# Altium schematic sheet 主控.SchDoc
size A2
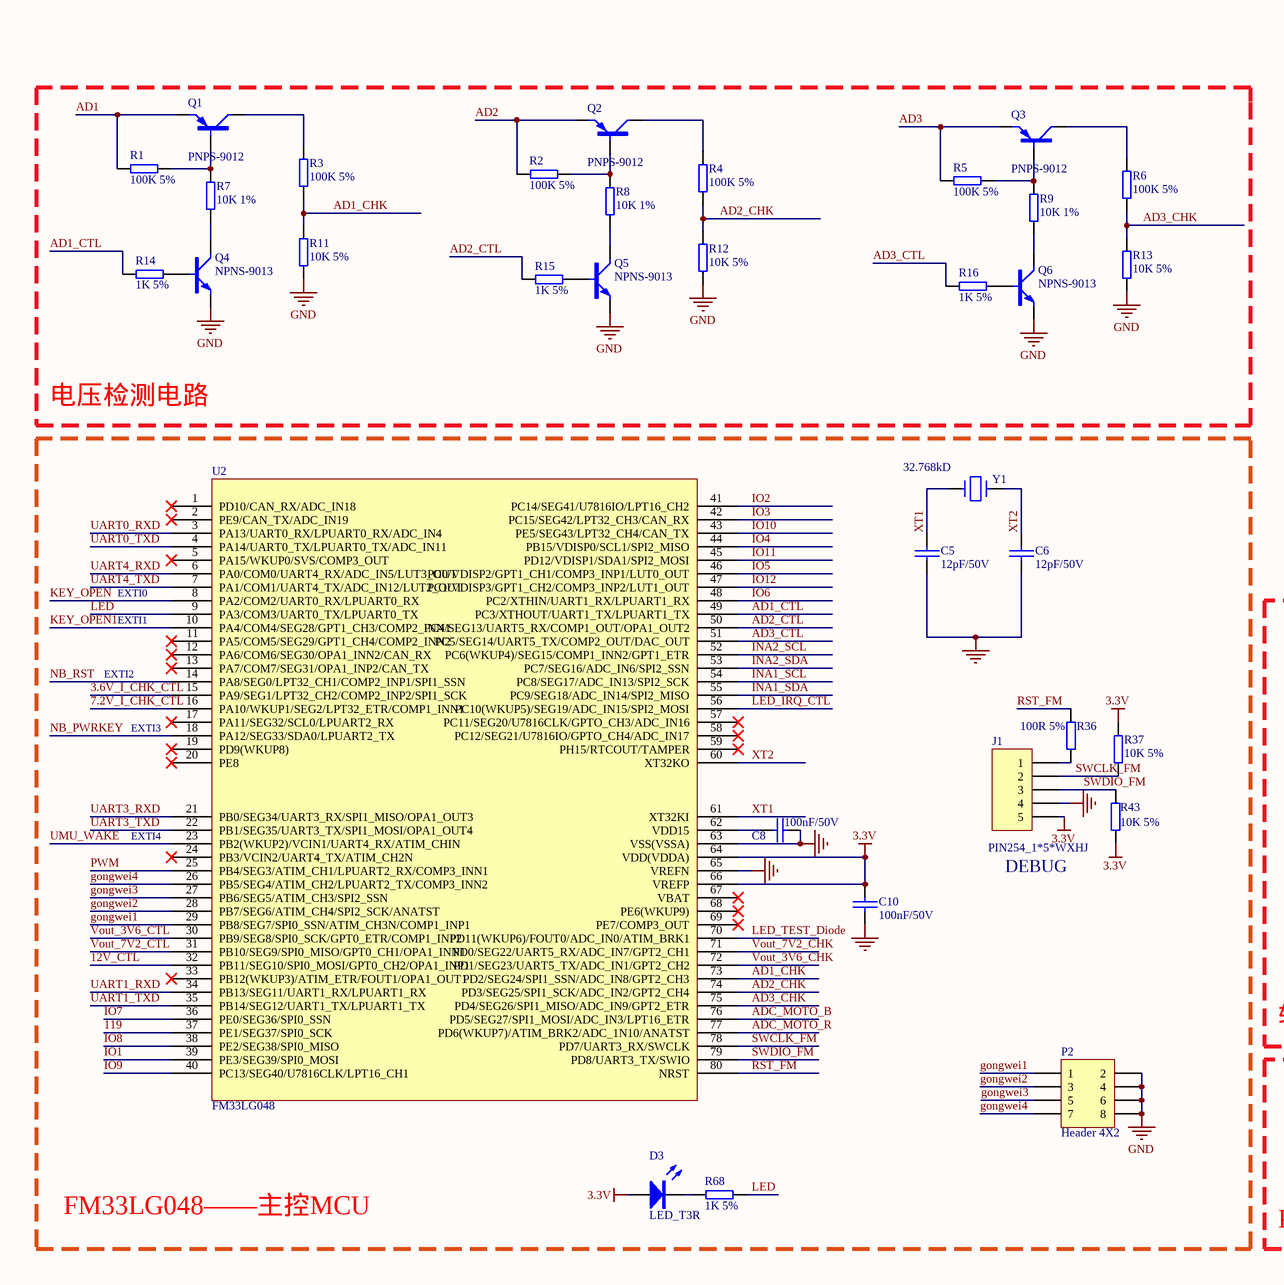
[diagram p0: 主控.SchDoc, left]
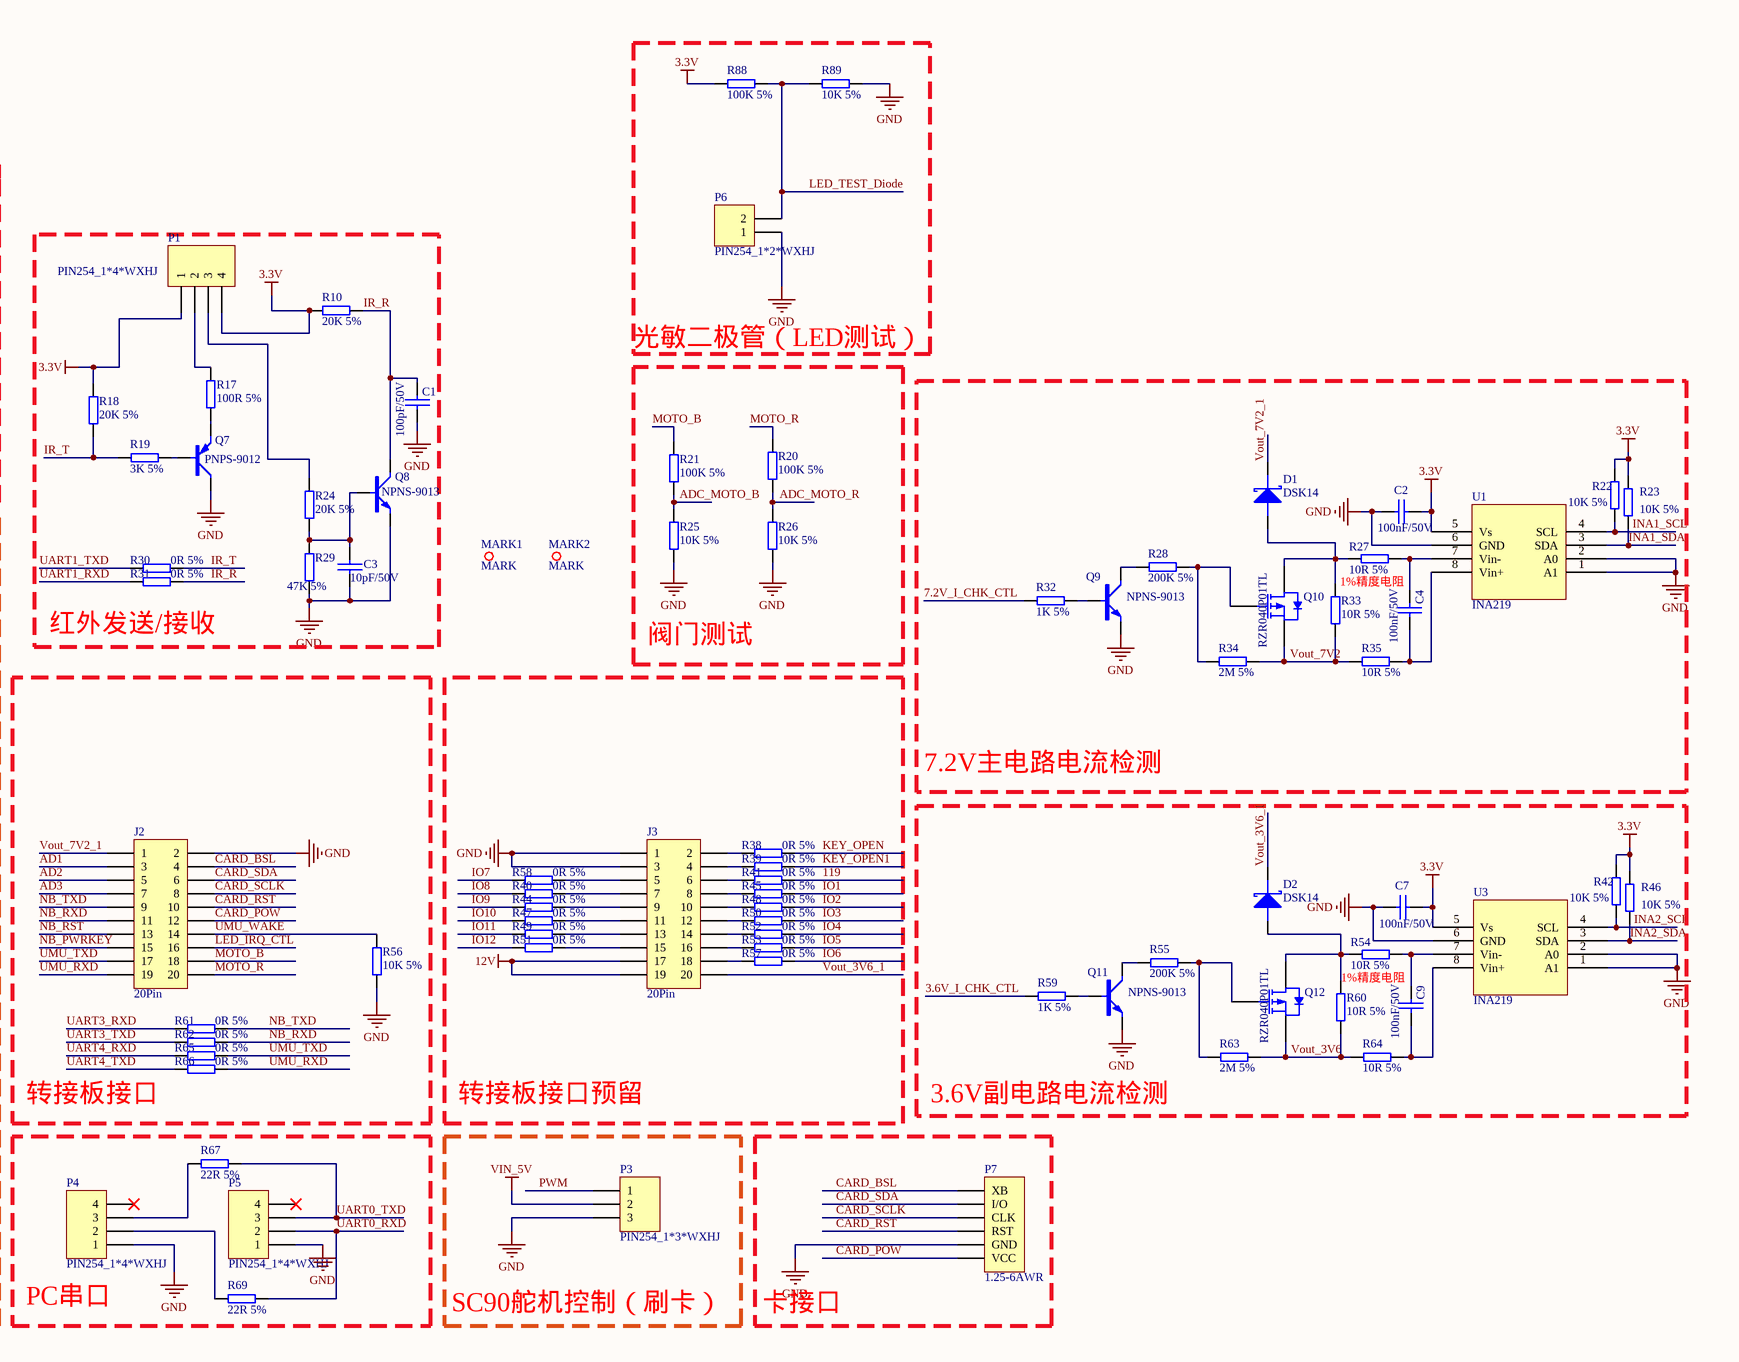
[diagram p1: 主控.SchDoc, right]

## Parts
C1  100pF/50V  [CAP0603]
C2  100nF/50V  [CAP0603]
C3  10pF/50V  [CAP0603]
C4  100nF/50V  [CAP0603]
C5  12pF/50V  [CAP0603]
C6  12pF/50V  [CAP0603]
C7  100nF/50V  [CAP0603]
C8  100nF/50V  [CAP0603]
C9  100nF/50V  [CAP0603]
C10  100nF/50V  [CAP0603]
D1  DSK14  [SOD-123FL]
D2  DSK14  [SOD-123FL]
D3  LED_T3R  [LED2_300]
J1  PIN254_1*5*WXHJ  [PIN254_1*5*1100S]
J2  20Pin  [DC254_2*10]
J3  20Pin  [DC254_2*10]
MARK1  MARK  [MARK]
MARK2  MARK  [MARK]
P1  PIN254_1*4*WXHJ  [PIN254_1*4*1100S]
P2  Header 4X2  [HDR2X4]
P3  PIN254_1*3*WXHJ  [PIN254_1*3*1100S]
P4  PIN254_1*4*WXHJ  [PIN254_1*4*1100S]
P5  PIN254_1*4*WXHJ  [PIN254_1*4*1100S]
P6  PIN254_1*2*WXHJ  [PIN254_1*2*1100S]
P7  1.25-6AWR  [SMT-1.25-6]
Q1  PNPS-9012  [SOT-23]
Q2  PNPS-9012  [SOT-23]
Q3  PNPS-9012  [SOT-23]
Q4  NPNS-9013  [SOT-23]
Q5  NPNS-9013  [SOT-23]
Q6  NPNS-9013  [SOT-23]
Q7  PNPS-9012  [SOT-23]
Q8  NPNS-9013  [SOT-23]
Q9  NPNS-9013  [SOT-23]
Q10  RZR040P01TL  [SOT-23]
Q11  NPNS-9013  [SOT-23]
Q12  RZR040P01TL  [SOT-23]
R1  100K 5%  [RES0603]
R2  100K 5%  [RES0603]
R3  100K 5%  [RES0603]
R4  100K 5%  [RES0603]
R5  100K 5%  [RES0603]
R6  100K 5%  [RES0603]
R7  10K 1%  [RES0603]
R8  10K 1%  [RES0603]
R9  10K 1%  [RES0603]
R10  20K 5%  [RES0603]
R11  10K 5%  [RES0603]
R12  10K 5%  [RES0603]
R13  10K 5%  [RES0603]
R14  1K 5%  [RES0603]
R15  1K 5%  [RES0603]
R16  1K 5%  [RES0603]
R17  100R 5%  [RES0603]
R18  20K 5%  [RES0603]
R19  3K 5%  [RES0603]
R20  100K 5%  [RES0603]
R21  100K 5%  [RES0603]
R22  10K 5%  [RES0603]
R23  10K 5%  [RES0603]
R24  20K 5%  [RES0603]
R25  10K 5%  [RES0603]
R26  10K 5%  [RES0603]
R27  10R 5%  [RES0603]
R28  200K 5%  [RES0603]
R29  47K 5%  [RES0603]
R30  0R 5%  [RES0603]
R31  0R 5%  [RES0603]
R32  1K 5%  [RES0603]
R33  10R 5%  [RES0603]
R34  2M 5%  [RES0603]
R35  10R 5%  [RES0603]
R36  100R 5%  [RES0603]
R37  10K 5%  [RES0603]
R38  0R 5%  [RES0603]
R39  0R 5%  [RES0603]
R40  0R 5%  [RES0603]
R41  0R 5%  [RES0603]
R42  10K 5%  [RES0603]
R43  10K 5%  [RES0603]
R44  0R 5%  [RES0603]
R45  0R 5%  [RES0603]
R46  10K 5%  [RES0603]
R47  0R 5%  [RES0603]
R48  0R 5%  [RES0603]
R49  0R 5%  [RES0603]
R50  0R 5%  [RES0603]
R51  0R 5%  [RES0603]
R52  0R 5%  [RES0603]
R53  0R 5%  [RES0603]
R54  10R 5%  [RES0603]
R55  200K 5%  [RES0603]
R56  10K 5%  [RES0603]
R57  0R 5%  [RES0603]
R58  0R 5%  [RES0603]
R59  1K 5%  [RES0603]
R60  10R 5%  [RES0603]
R61  0R 5%  [RES0603]
R62  0R 5%  [RES0603]
R63  2M 5%  [RES0603]
R64  10R 5%  [RES0603]
R65  0R 5%  [RES0603]
R66  0R 5%  [RES0603]
R67  22R 5%  [RES0603]
R68  1K 5%  [RES0603]
R69  22R 5%  [RES0603]
R88  100K 5%  [RES0603]
R89  10K 5%  [RES0603]
U1  INA219  [SO-8]
U2  FM33LG048  [LQFP80]
U3  INA219  [SO-8]
Y1  32.768kD  [SMD-3215_2P]

## Blocks framed on the sheet
光敏二极管（LED测试）: P6 R88 R89
电压检测电路: Q1-Q6 R1-R9 R11-R16
红外发送/接收: C1 C3 P1 Q7 Q8 R10 R17-R19 R24 R29-R31
7.2V主电路电流检测: C2 C4 D1 Q9 Q10 R22 R23 R27 R28 R32-R35 U1
FM33LG048——主控MCU: C5 C6 C8 C10 D3 J1 P2 R36 R37 R43 R68 U2 Y1
转接板接口: J2 R56 R61 R62 R65 R66
转接板接口预留: J3 R38-R41 R44 R45 R47-R53 R57 R58
3.6V副电路电流检测: C7 C9 D2 Q11 Q12 R42 R46 R54 R55 R59 R60 R63 R64 U3
PC串口: P4 P5 R67 R69
SC90舵机控制（刷卡）: P3
卡接口: P7

## Nets
3.3V: C2.2 C7.2 C10.2 D3.1 J1.5 P1.1 P1.4 R10.1 R18.2 R22.1 R23.1 R37.1 R42.1 R43.1 R46.1 R88.1 U1.5(Vs) U2.64(VDD(VDDA)) U2.66(VREFP) U3.5(Vs)
12V: J3.17 J3.19
GND: C1.2 C2.1 C3.2 C5.2 C6.1 C7.1 C8.2 C10.1 J1.4 J2.2 J3.1 J3.3 P2.2 P2.4 P2.6 P2.8 P3.3 P4.1 P5.1 P6.1 P7.5(GND) Q4.2(E) Q5.2(E) Q6.2(E) Q7.3(C) Q8.2(E) Q9.2(E) Q11.2(E) R11.2 R12.2 R13.2 R25.1 R26.1 R29.1 R56.1 R89.1 U1.1(A1) U1.2(A0) U1.6(GND) U2.63(VSS(VSSA)) U2.65(VREFN) U3.1(A1) U3.2(A0) U3.6(GND)
VIN_5V: P3.2
3.6V_I_CHK_CTL: R59.2 U2.15(PA9/SEG1/LPT32_CH2/COMP2_INP2/SPI1_SCK)
7.2V_I_CHK_CTL: R32.2 U2.16(PA10/WKUP1/SEG2/LPT32_ETR/COMP1_INN1)
12V_CTL: U2.32(PB11/SEG10/SPI0_MOSI/GPT0_CH2/OPA1_INP1)
119: R41.2 U2.37(PE1/SEG37/SPI0_SCK)
AD1: J2.3 Q1.2(E) R1.2
AD1_CHK: R3.2 R11.1 U2.73(PD2/SEG24/SPI1_SSN/ADC_IN8/GPT2_CH3)
AD1_CTL: R14.1 U2.49(PC3/XTHOUT/UART1_TX/LPUART1_TX)
AD2: J2.5 Q2.2(E) R2.2
AD2_CHK: R4.2 R12.1 U2.74(PD3/SEG25/SPI1_SCK/ADC_IN2/GPT2_CH4)
AD2_CTL: R15.1 U2.50(PC4/SEG13/UART5_RX/COMP1_OUT/OPA1_OUT2)
AD3: J2.7 Q3.2(E) R5.2
AD3_CHK: R6.2 R13.1 U2.75(PD4/SEG26/SPI1_MISO/ADC_IN9/GPT2_ETR)
AD3_CTL: R16.1 U2.51(PC5/SEG14/UART5_TX/COMP2_OUT/DAC_OUT)
ADC_MOTO_B: R21.1 R25.2 U2.76(PD5/SEG27/SPI1_MOSI/ADC_IN3/LPT16_ETR)
ADC_MOTO_R: R20.1 R26.2 U2.77(PD6(WKUP7)/ATIM_BRK2/ADC_1N10/ANATST)
CARD_BSL: J2.4 P7.1(XB)
CARD_POW: J2.12 P7.6(VCC)
CARD_RST: J2.10 P7.4(RST)
CARD_SCLK: J2.8 P7.3(CLK)
CARD_SDA: J2.6 P7.2(I/O)
gongwei1: P2.1 U2.29(PB8/SEG7/SPI0_SSN/ATIM_CH3N/COMP1_INP1)
gongwei2: P2.3 U2.28(PB7/SEG6/ATIM_CH4/SPI2_SCK/ANATST)
gongwei3: P2.5 U2.27(PB6/SEG5/ATIM_CH3/SPI2_SSN)
gongwei4: P2.7 U2.26(PB5/SEG4/ATIM_CH2/LPUART2_TX/COMP3_INN2)
INA1_SCL: R22.2 U1.4(SCL) U2.54(PC8/SEG17/ADC_IN13/SPI2_SCK)
INA1_SDA: R23.2 U1.3(SDA) U2.55(PC9/SEG18/ADC_IN14/SPI2_MISO)
INA2_SCL: R42.2 U2.52(PC6(WKUP4)/SEG15/COMP1_INN2/GPT1_ETR) U3.4(SCL)
INA2_SDA: R46.2 U2.53(PC7/SEG16/ADC_IN6/SPI2_SSN) U3.3(SDA)
IO1: R45.2 U2.39(PE3/SEG39/SPI0_MOSI)
IO2: R48.2 U2.41(PC14/SEG41/U7816IO/LPT16_CH2)
IO3: R50.2 U2.42(PC15/SEG42/LPT32_CH3/CAN_RX)
IO4: R52.2 U2.44(PB15/VDISP0/SCL1/SPI2_MISO)
IO5: R53.2 U2.46(PC0/VDISP2/GPT1_CH1/COMP3_INP1/LUT0_OUT)
IO6: R57.2 U2.48(PC2/XTHIN/UART1_RX/LPUART1_RX)
IO7: R58.1 U2.36(PE0/SEG36/SPI0_SSN)
IO8: R40.1 U2.38(PE2/SEG38/SPI0_MISO)
IO9: R44.1 U2.40(PC13/SEG40/U7816CLK/LPT16_CH1)
IO10: R47.1 U2.43(PE5/SEG43/LPT32_CH4/CAN_TX)
IO11: R49.1 U2.45(PD12/VDISP1/SDA1/SPI2_MOSI)
IO12: R51.1 U2.47(PC1/VDISP3/GPT1_CH2/COMP3_INP2/LUT1_OUT)
IR_R: C1.1 Q8.3(C) R10.2 R31.2
IR_T: R18.1 R19.1 R30.2
KEY_OPEN: R38.2 U2.8(PA2/COM2/UART0_RX/LPUART0_RX)
KEY_OPEN1: R39.2 U2.10(PA4/COM4/SEG28/GPT1_CH3/COMP2_INN1)
LED: R68.1 U2.9(PA3/COM3/UART0_TX/LPUART0_TX)
LED_IRQ_CTL: J2.16 U2.56(PC10(WKUP5)/SEG19/ADC_IN15/SPI2_MOSI)
LED_TEST_Diode: P6.2 R88.2 R89.2 U2.70(PD11(WKUP6)/FOUT0/ADC_IN0/ATIM_BRK1)
MOTO_B: J2.18 R21.2
MOTO_R: J2.20 R20.2
NB_PWRKEY: J2.15 U2.18(PA12/SEG33/SDA0/LPUART2_TX)
NB_RST: J2.13 U2.14(PA8/SEG0/LPT32_CH1/COMP2_INP1/SPI1_SSN)
NB_RXD: J2.11 R62.2
NB_TXD: J2.9 R61.2
PWM: P3.1 U2.25(PB4/SEG3/ATIM_CH1/LPUART2_RX/COMP3_INN1)
RST_FM: R36.1 U2.80(NRST)
SWCLK_FM: J1.2 R37.2 U2.78(PD7/UART3_RX/SWCLK)
SWDIO_FM: J1.3 R43.2 U2.79(PD8/UART3_TX/SWIO)
UART0_RXD: P5.2 R69.2 U2.3(PA13/UART0_RX/LPUART0_RX/ADC_IN4)
UART0_TXD: P5.3 R67.2 U2.4(PA14/UART0_TX/LPUART0_TX/ADC_IN11)
UART1_RXD: R31.1 U2.34(PB13/SEG11/UART1_RX/LPUART1_RX)
UART1_TXD: R30.1 U2.35(PB14/SEG12/UART1_TX/LPUART1_TX)
UART3_RXD: R61.1 U2.21(PB0/SEG34/UART3_RX/SPI1_MISO/OPA1_OUT3)
UART3_TXD: R62.1 U2.22(PB1/SEG35/UART3_TX/SPI1_MOSI/OPA1_OUT4)
UART4_RXD: R65.1 U2.6(PA0/COM0/UART4_RX/ADC_IN5/LUT3_OUT)
UART4_TXD: R66.1 U2.7(PA1/COM1/UART4_TX/ADC_IN12/LUT2_OUT)
UMU_RXD: J2.19 R66.2
UMU_TXD: J2.17 R65.2
UMU_WAKE: J2.14 R56.2 U2.23(PB2(WKUP2)/VCIN1/UART4_RX/ATIM_CHIN)
Vout_3V6: Q12.2(S) R60.1 R63.2 R64.1
Vout_3V6_1: D2.2 J3.20
Vout_3V6_CHK: U2.72(PD1/SEG23/UART5_TX/ADC_IN1/GPT2_CH2)
Vout_3V6_CTL: U2.30(PB9/SEG8/SPI0_SCK/GPT0_ETR/COMP1_INP2)
Vout_7V2: Q10.2(S) R33.1 R34.2 R35.1
Vout_7V2_1: D1.2 J2.1
Vout_7V2_CHK: U2.71(PD0/SEG22/UART5_RX/ADC_IN7/GPT2_CH1)
Vout_7V2_CTL: U2.31(PB10/SEG9/SPI0_MISO/GPT0_CH1/OPA1_INN1)
XT1: C5.1 U2.61(XT32KI) Y1.1
XT2: C6.2 U2.60(XT32KO) Y1.2
NetC3_1: C3.1 Q8.1(B) R24.1 R29.2
NetC4_1: C4.1 R27.2 U1.7(Vin-)
NetC4_2: C4.2 R35.2 U1.8(Vin+)
NetC8_1: C8.1 U2.62(VDD15)
NetC9_1: C9.1 R54.2 U3.7(Vin-)
NetC9_2: C9.2 R64.2 U3.8(Vin+)
NetD1_1: D1.1 Q10.3(D) R27.1 R33.2
NetD2_1: D2.1 Q12.3(D) R54.1 R60.2
NetD3_2: D3.2 R68.2
NetJ1_1: J1.1 R36.2
NetJ3_2: J3.2 R38.1
NetJ3_4: J3.4 R39.1
NetJ3_5: J3.5 R58.2
NetJ3_6: J3.6 R41.1
NetJ3_7: J3.7 R40.2
NetJ3_8: J3.8 R45.1
NetJ3_9: J3.9 R44.2
NetJ3_10: J3.10 R48.1
NetJ3_11: J3.11 R47.2
NetJ3_12: J3.12 R50.1
NetJ3_13: J3.13 R49.2
NetJ3_14: J3.14 R52.1
NetJ3_15: J3.15 R51.2
NetJ3_16: J3.16 R53.1
NetJ3_18: J3.18 R57.1
NetP1_2: P1.2 R17.2
NetP1_3: P1.3 R24.2
NetP4_2: P4.2 R69.1
NetP4_3: P4.3 R67.1
NetQ1_1: Q1.1(B) R1.1 R7.1
NetQ1_3: Q1.3(C) R3.1
NetQ2_1: Q2.1(B) R2.1 R8.1
NetQ2_3: Q2.3(C) R4.1
NetQ3_1: Q3.1(B) R5.1 R9.1
NetQ3_3: Q3.3(C) R6.1
NetQ4_1: Q4.1(B) R14.2
NetQ4_3: Q4.3(C) R7.2
NetQ5_1: Q5.1(B) R15.2
NetQ5_3: Q5.3(C) R8.2
NetQ6_1: Q6.1(B) R16.2
NetQ6_3: Q6.3(C) R9.2
NetQ7_1: Q7.1(B) R19.2
NetQ7_2: Q7.2(E) R17.1
NetQ9_1: Q9.1(B) R32.1
NetQ9_3: Q9.3(C) R28.2
NetQ10_1: Q10.1(G) R28.1 R34.1
NetQ11_1: Q11.1(B) R59.1
NetQ11_3: Q11.3(C) R55.2
NetQ12_1: Q12.1(G) R55.1 R63.1

Not connected (* = marked no-connect by the designer): P4 4*; P5 4*; U2 1(PD10/CAN_RX/ADC_IN18)* 2(PE9/CAN_TX/ADC_IN19)* 5(PA15/WKUP0/SVS/COMP3_OUT)* 11(PA5/COM5/SEG29/GPT1_CH4/COMP2_INN2)* 12(PA6/COM6/SEG30/OPA1_INN2/CAN_RX)* 13(PA7/COM7/SEG31/OPA1_INP2/CAN_TX)* 17(PA11/SEG32/SCL0/LPUART2_RX)* 19(PD9(WKUP8))* 20(PE8)* 24(PB3/VCIN2/UART4_TX/ATIM_CH2N)* 33(PB12(WKUP3)/ATIM_ETR/FOUT1/OPA1_OUT1)* 57(PC11/SEG20/U7816CLK/GPTO_CH3/ADC_IN16)* 58(PC12/SEG21/U7816IO/GPTO_CH4/ADC_IN17)* 59(PH15/RTCOUT/TAMPER)* 67(VBAT)* 68(PE6(WKUP9))* 69(PE7/COMP3_OUT)*

## Notes on the sheet
- (near R33) 1%精度电阻
- 阀门测试
- EXTI0
- EXTI1
- EXTI2
- (near U2) EXTI3
- (near U2) EXTI4
- (near J1) DEBUG
- (near R60) 1%精度电阻

## Library data of the parts
C1 = 101020103-0010: 101pf,50 V,±5%,0603,国巨,CC0603JRNP09BN101; Part Name: 0603贴片电容; ID: 4; SMD/DIP: SMD; Part Number: 101020103-0010
C2 C4 C7-C10 = 101020103-0021: 104pF,50 V,±10%,0603,国巨,CC0603KRX7R9BB104; Part Name: 0603贴片电容; ID: 3; SMD/DIP: SMD; Part Number: 101020103-0021
C3 = 101020103-0014: 10pF,50 V,±5%,0603,X7R,国巨,CC0603JRNPO9BN100; Part Name: 0603贴片电容; ID: 7; SMD/DIP: SMD; Part Number: 101020103-0014
C5 C6 = 101020103-0005: 12P,50 V,±5%,0603,国巨,CC0603JRNPO9BN12; Part Name: 0603贴片电容; ID: 11; SMD/DIP: SMD; Part Number: 101020103-0005
D1 D2 = 101040101-0043: DSK14,SOD-123FL,1 A,40 V,28 V,台湾强茂集团苏州群鑫电子,DSK14; Part Name: 二极管; ID: 10; SMD/DIP: SMD; Part Number: 101040101-0043
D3 = 101040102-0001: 圆形插件,3mm 圆形,插件,红光,湖北匡通电子有限公司,3BB4HC; Part Name: 发光二极管; ID: 6; SMD/DIP: DIP; Part Number: 101040102-0001
J1 = AD_WXHJ_PinHeader_02: 1*5 ，Φ1.0 ，2.54mm，直脚,无需焊接器件; Part Name: 排针; ID: 17; SMD/DIP: DIP; Part Number: AD_WXHJ_PinHeader_02
J2 J3 = 1010902-0139: DC2 2.54mm 2x10pin,2.54mm间距，2x10pin，32×8.55×27.5mm,母头,双排,双排牛角座; Part Name: DC牛角座; ID: 4; SMD/DIP: DIP; Part Number: 1010902-0139
MARK1 MARK2 = MARK: MARK点; Part Number: AD_WXHJ_MARK_01; ID: 8; SMD/DIP: SMD; Part Name: MARK点
P1 P4 P5 = AD_WXHJ_PinHeader_01: 1*4 ，Φ1.0 ，2.54mm，直脚,无需焊接器件; Part Name: 排针; ID: 16; SMD/DIP: DIP; Part Number: AD_WXHJ_PinHeader_01
P2 = Header 4X2: Header, 4-Pin, Dual row
P3 = AD_WXHJ_PinHeader_01: 1*3 ，Φ1.0 ，2.54mm，直脚,无需焊接器件; Part Name: 排针; ID: 16; SMD/DIP: DIP; Part Number: AD_WXHJ_PinHeader_01
P6 = AD_WXHJ_PinHeader_01: 1*2 ，Φ1.0 ，2.54mm，直脚,无需焊接器件; Part Name: 排针; ID: 16; SMD/DIP: DIP; Part Number: AD_WXHJ_PinHeader_01
P7 = 1010902-0121: 1.25-6AWR 卷,6针1.25mm,母头,单排,贴片卧式; Part Name: 插座; ID: 32; SMD/DIP: SMD; Part Number: 1010902-0121
Q1-Q3 Q7 = 101040201-0001: 9012,PNP,SOT-23,JCET;长电,S9012; Part Name: 贴片三极管; ID: 17; SMD/DIP: SMD; Part Number: 101040201-0001
Q4-Q6 Q8 Q9 Q11 = 101040201-0002: 9013,NPN,SOT-23,长电,S9013; Part Name: 贴片三极管; ID: 15; SMD/DIP: SMD; Part Number: 101040201-0002
Q10 Q12 = 101040201-0010: RZR040P01TL；1.5v导通,P-MOS,SOT-23,罗姆,RZR040P01TL; Part Name: PMOS管; ID: 18; SMD/DIP: SMD; Part Number: 101040201-0010
R1-R6 R88 = 101010103-0005: 国巨,±5%,0603,,155 ℃,-55 ℃,RC0603JR-07100KL,无铅,100 ppm/℃,1/10W,,100K; Part Name: 0603贴片电阻; ID: 3; SMD/DIP: SMD; Part Number: 101010103-0005
R7-R9 = 101010103-0052: 10K±1%,1/10W,0603; Part Name: 0603贴片电阻; ID: 6; SMD/DIP: SMD; Part Number: 101010103-0052
R10 R18 R24 = 101010103-0004: 国巨,±5%,0603,,155 ℃,-55 ℃,RC0603JR-0720KL,无铅,200 ppm/℃,1/10W,,20K; Part Name: 0603贴片电阻; ID: 15; SMD/DIP: SMD; Part Number: 101010103-0004
R11-R13 R22 R23 R25 R26 R37 R42 R43 R46 R56 R89 = 101010103-0003: 国巨,±5%,0603,,155 ℃,-55 ℃,RC0603JR-0710KL,无铅,200 ppm/℃,1/10W,,10K; Part Name: 0603贴片电阻; ID: 7; SMD/DIP: SMD; Part Number: 101010103-0003
R14-R16 R32 R59 = 101010103-0008: 1K,±5%,1/10W,0603,国巨,RC0603JR-071KL; Part Name: 0603贴片电阻; ID: 10; SMD/DIP: SMD; Part Number: 101010103-0008
R17 R36 = 101010103-0022: 100R,±5%,1/10W,0603,国巨,RC0603JR-07100RL; Part Name: 0603贴片电阻; ID: 5; SMD/DIP: SMD; Part Number: 101010103-0022
R19 = 101010103-0006: 国巨,±5%,0603,,155 ℃,-55 ℃,RC0603JR-073KL,无铅,100 ppm/℃,1/10W,,3K; Part Name: 0603贴片电阻; ID: 23; SMD/DIP: SMD; Part Number: 101010103-0006
R20 R21 = 101010103-0005: 100K±5%,1/10W,0603; Part Name: 0603贴片电阻; ID: 30; Part Number: 101010103-0005
R27 R33 R35 R54 R60 R64 = 101010103-0017: 10R,±5%,1/10W,0603,国巨,RC0603JR-0710RL; Part Name: 0603贴片电阻; ID: 8; SMD/DIP: SMD; Part Number: 101010103-0017
R28 R55 = 101010103-0034: 200K,±5%,1/10W,0603,国巨,RC0603JR-07200KL; Part Name: 0603贴片电阻; ID: 13; SMD/DIP: SMD; Part Number: 101010103-0034
R29 = 101010103-0012: 47K,±5%,1/10W,0603,国巨,RC0603JR-0747KL; Part Name: 0603贴片电阻; ID: 26; SMD/DIP: SMD; Part Number: 101010103-0012
R30 R31 R38-R41 R44 R45 R47-R53 R57 R58 R61 R62 R65 R66 = 101010103-0001: 国巨,±5%,0603,,155 ℃,-55 ℃,RC0603J2-070RL,无铅,200 ppm/℃,1/10W,,0R; Part Name: 0603贴片电阻; ID: 1; SMD/DIP: SMD; Part Number: 101010103-0001
R34 R63 = 101010103-0025: 国巨,±5%,0603,,155 ℃,-55 ℃,RC0603JR-072ML,含铅,100 ppm/℃,1/10W,,2M; Part Name: 0603贴片电阻; ID: 20; SMD/DIP: SMD; Part Number: 101010103-0025
R67 R69 = 101010103-0009: 国巨,±5%,0603,,155 ℃,-55 ℃,RC0603JR-0722RL,无铅,200 ppm/℃,1/10W,,22欧; Part Name: 0603贴片电阻; ID: 18; SMD/DIP: SMD; Part Number: 101010103-0009
R68 = 101010103-0008: 1K,±5%,1/10W,0603,国巨,RC0603JR-071KL; Part Name: 0603贴片电阻; ID: 9; SMD/DIP: SMD; Part Number: 101010103-0008
U2 = FM33LG048: 101050101-0261
Y1 = 1010601-0009: Part Number: 1010601-0020; Part Name: 贴片晶振; ID: 20; SMD/DIP: SMD